# EAGLE schematic L1Demoscene (EAGLE 6.5.0)

## Sheet 1 of 2
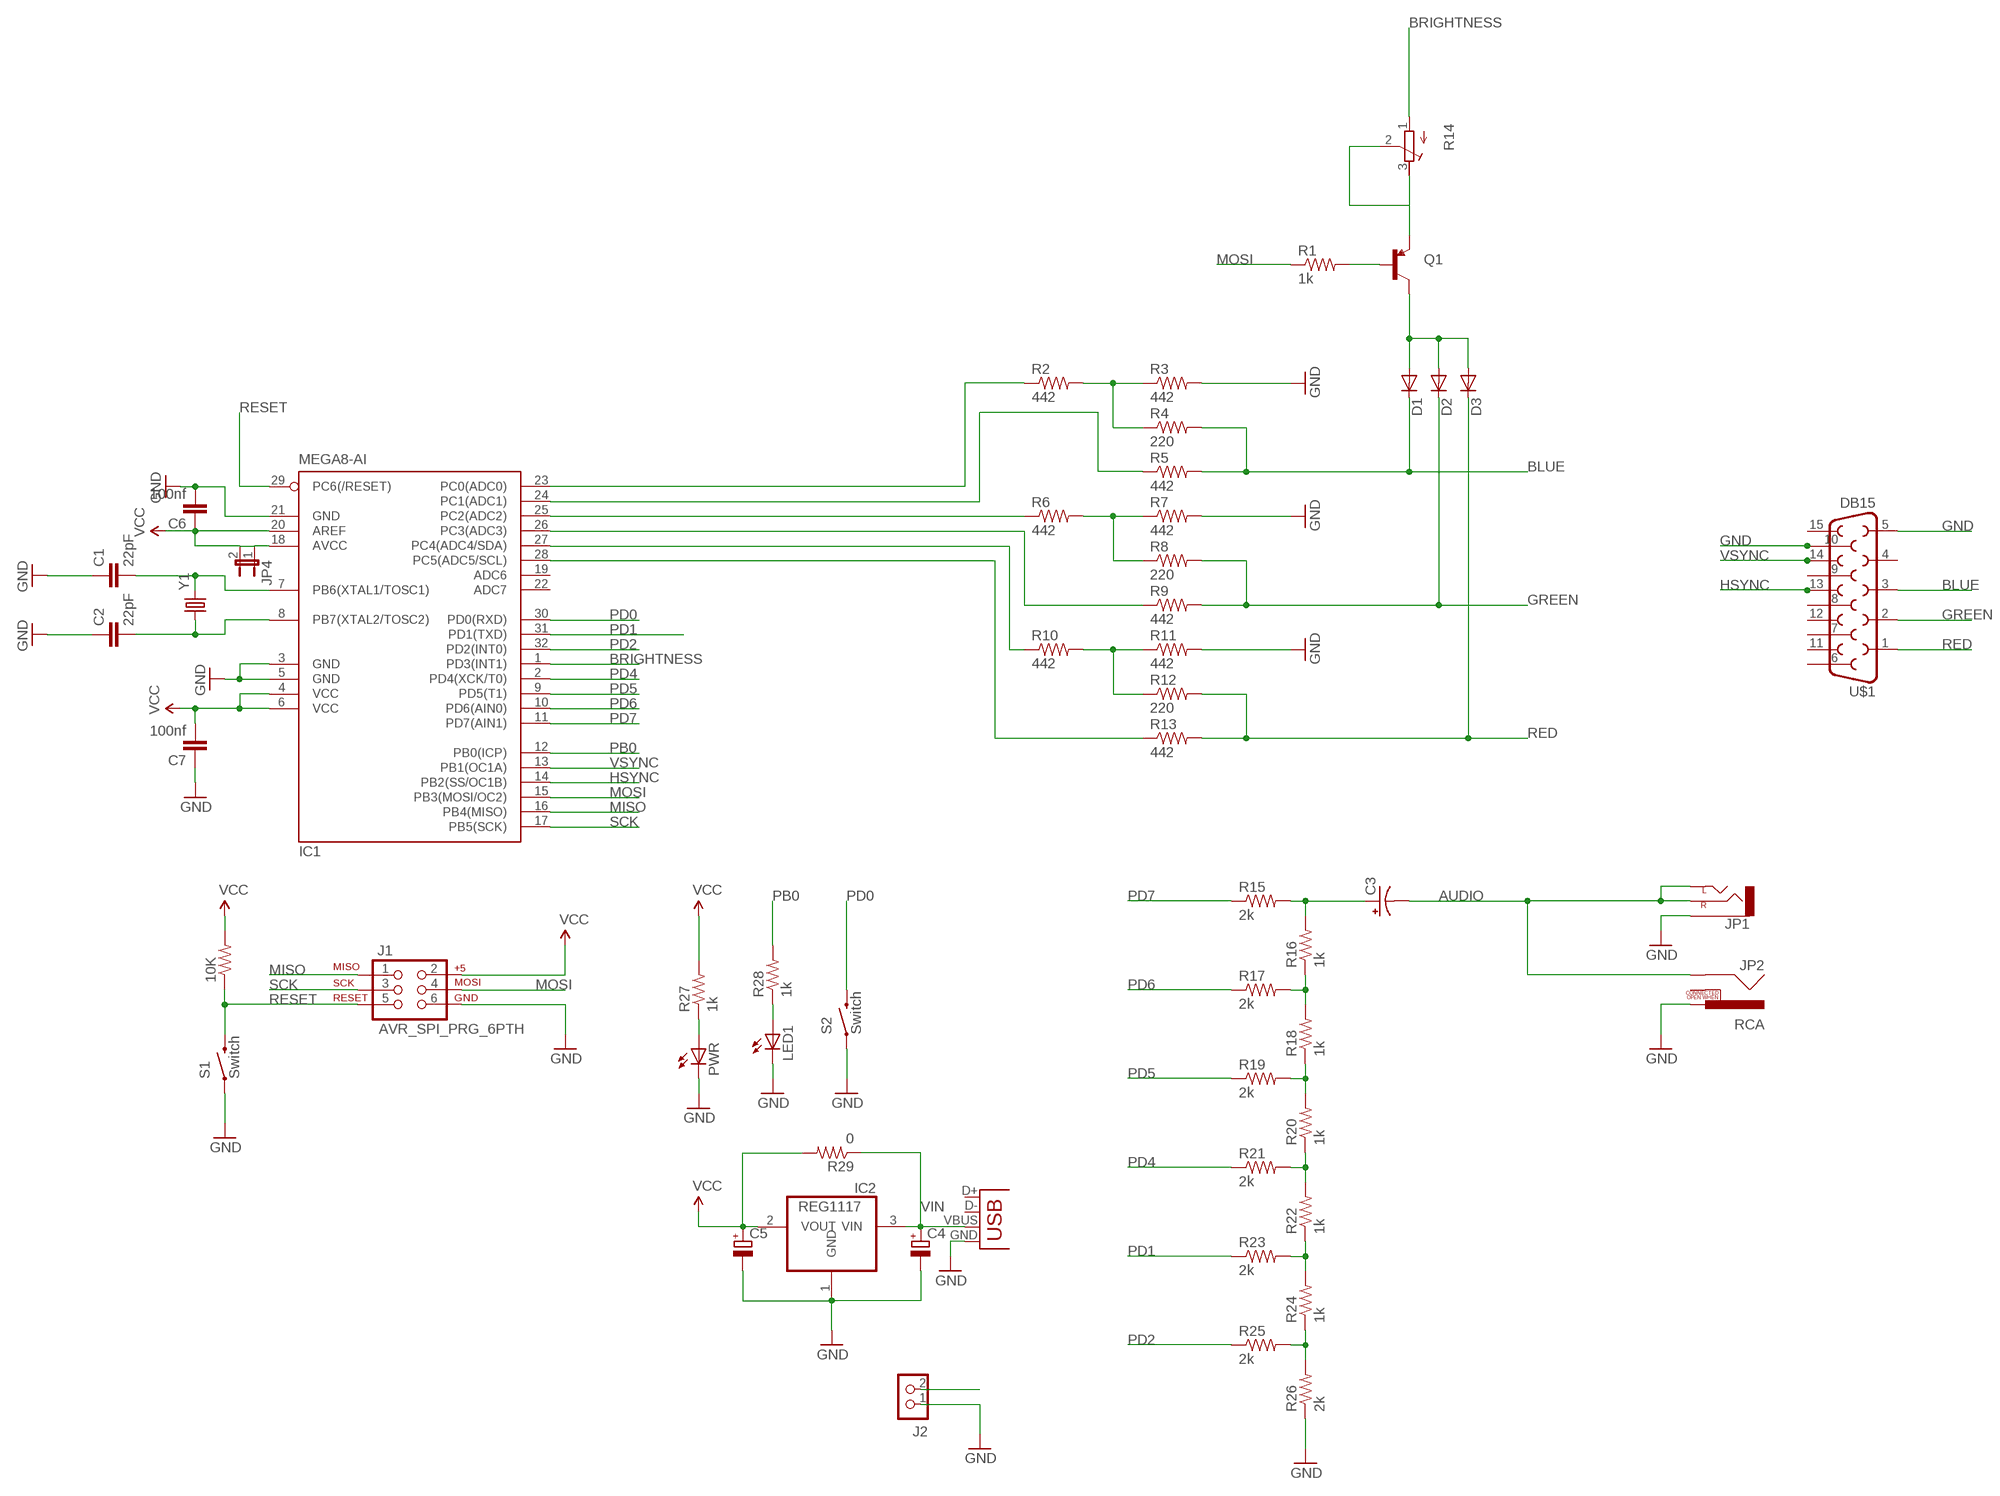
[diagram p0: schematic, sheet 1]

### Parts
10K  RESISTOR0603-RES  [0603-RES]
C1  22pF  CAP0603-CAP  [0603-CAP]
C2  22pF  CAP0603-CAP  [0603-CAP]
C3  CAP_POL1206  [EIA3216]
C4  CAPACITOR_POL-SMC_A  [SMC_A]
C5  CAPACITOR_POL-SMC_A  [SMC_A]
C6  100nf  CAP0603-CAP  [0603-CAP]
C7  100nf  CAP0603-CAP  [0603-CAP]
D1  DIODESOD  [SOD-323]
D2  DIODESOD  [SOD-323]
D3  DIODESOD  [SOD-323]
IC1  MEGA8-AI  [TQFP32-08]
IC2  REG1117  [SOT223]
J1  AVR_SPI_PRG_6PTH  [2X3]
J2  CON_HEADER_1X02-PTH  [M1X2]
JP1  AUDIO-JACKPTH  [AUDIO-JACK]
JP2  RCA  [RCA]
JP3  USB-MICROB  [USB-MICROB]
JP4  JUMPER-2SMD-NC  [SJ_2S]
LED1  LED-0603  [LED-603]
PWR  LED-0603  [LED-603]
Q1  TRANSISTOR_PNPSMD  [SOT23-3]
R1  1k  RESISTOR0603-RES  [0603-RES]
R2  442  RESISTOR0603-RES  [0603-RES]
R3  442  RESISTOR0603-RES  [0603-RES]
R4  220  RESISTOR0603-RES  [0603-RES]
R5  442  RESISTOR0603-RES  [0603-RES]
R6  442  RESISTOR0603-RES  [0603-RES]
R7  442  RESISTOR0603-RES  [0603-RES]
R8  220  RESISTOR0603-RES  [0603-RES]
R9  442  RESISTOR0603-RES  [0603-RES]
R10  442  RESISTOR0603-RES  [0603-RES]
R11  442  RESISTOR0603-RES  [0603-RES]
R12  220  RESISTOR0603-RES  [0603-RES]
R13  442  RESISTOR0603-RES  [0603-RES]
R14  R-TRIMM3296W  [RTRIM3296W]
R15  2k  RESISTOR0603-RES  [0603-RES]
R16  1k  RESISTOR0603-RES  [0603-RES]
R17  2k  RESISTOR0603-RES  [0603-RES]
R18  1k  RESISTOR0603-RES  [0603-RES]
R19  2k  RESISTOR0603-RES  [0603-RES]
R20  1k  RESISTOR0603-RES  [0603-RES]
R21  2k  RESISTOR0603-RES  [0603-RES]
R22  1k  RESISTOR0603-RES  [0603-RES]
R23  2k  RESISTOR0603-RES  [0603-RES]
R24  1k  RESISTOR0603-RES  [0603-RES]
R25  2k  RESISTOR0603-RES  [0603-RES]
R26  2k  RESISTOR0603-RES  [0603-RES]
R27  1k  RESISTOR0603-RES  [0603-RES]
R28  1k  RESISTOR0603-RES  [0603-RES]
R29  0  RESISTOR1206  [1206]
S1  Switch  SPARKFUN-ELECTROMECHANICAL_SWITCH-MOMENTARY-2-SMD-1101NE  [SPARKFUN-ELECTROMECHANICAL_TACTILE-SWITCH-1101NE]
S2  Switch  SPARKFUN-ELECTROMECHANICAL_SWITCH-MOMENTARY-2-SMD-1101NE  [SPARKFUN-ELECTROMECHANICAL_TACTILE-SWITCH-1101NE]
U$1  DB15  [DB15]
Y1  CRYSTALHC49US  [HC49US]

### Nets
AUDIO: C3.C(-) JP1.RING(RIGHT) JP1.TIP(LEFT) JP2.SHELL
BLUE: D1.1(C) R4.2 R5.2 U$1.3
BRIGHTNESS: IC1.1(PD3(INT1)) R14.1(A)
GND: C1.1 C2.1 C4.- C5.- C6.2 C7.1 IC1.3(GND) IC1.5(GND) IC1.21(GND) IC2.1(GND) J1.6 J2.1 JP1.SLEEVE JP2.PIN JP3.GND LED1.C PWR.C R3.2 R7.2 R11.2 R26.1 S1.P$1 S2.P$1 U$1.5 U$1.10
GREEN: D2.1(C) R8.2 R9.2 U$1.2
HSYNC: IC1.14(PB2(SS/OC1B)) U$1.13
MISO: IC1.16(PB4(MISO)) J1.1
MOSI: IC1.15(PB3(MOSI/OC2)) J1.4 R1.1
N$1: C1.2 IC1.7(PB6(XTAL1/TOSC1)) Y1.2
N$2: C2.2 IC1.8(PB7(XTAL2/TOSC2)) Y1.1
N$3: IC1.23(PC0(ADC0)) R2.1
N$4: R2.2 R3.1 R4.1
N$5: D1.2(A) D2.2(A) D3.2(A) Q1.3(C)
N$6: Q1.1(B) R1.2
N$7: IC1.24(PC1(ADC1)) R5.1
N$8: IC1.25(PC2(ADC2)) R6.1
N$9: R6.2 R7.1 R8.1
N$10: PWR.A R27.1
N$11: IC1.26(PC3(ADC3)) R9.1
N$12: IC1.28(PC5(ADC5/SCL)) R13.1
N$13: LED1.A R28.1
N$14: IC1.27(PC4(ADC4/SDA)) R10.1
N$15: R10.2 R11.1 R12.1
N$16: Q1.2(E) R14.2(S) R14.3(E)
N$21: C3.A(+) R15.2 R16.2
N$22: R16.1 R17.2 R18.2
N$23: R18.1 R19.2 R20.2
N$24: R20.1 R21.2 R22.2
N$25: R22.1 R23.2 R24.2
N$26: R24.1 R25.2 R26.2
PB0: IC1.12(PB0(ICP)) R28.2
PD0: IC1.30(PD0(RXD)) S2.P$2
PD1: IC1.31(PD1(TXD)) R23.1
PD2: IC1.32(PD2(INT0)) R25.1
PD4: IC1.2(PD4(XCK/T0)) R21.1
PD5: IC1.9(PD5(T1)) R19.1
PD6: IC1.10(PD6(AIN0)) R17.1
PD7: IC1.11(PD7(AIN1)) R15.1
RED: D3.1(C) R12.2 R13.2 U$1.1
RESET: 10K.1 IC1.29(PC6(/RESET)) J1.5 S1.P$2
SCK: IC1.17(PB5(SCK)) J1.3
VCC: 10K.2 C5.+ C6.1 C7.2 IC1.4(VCC) IC1.6(VCC) IC1.18(AVCC) IC1.20(AREF) IC2.2(VOUT) J1.2 JP4.1 JP4.2 R27.2 R29.2
VIN: C4.+ IC2.3(VIN) J2.2 JP3.VBUS R29.1
VSYNC: IC1.13(PB1(OC1A)) U$1.14
Unconnected: IC1.19(ADC6) IC1.22(ADC7) JP2.SWITCH JP3.D+ JP3.D- U$1.4 U$1.6 U$1.7 U$1.8 U$1.9 U$1.11 U$1.12 U$1.15

## Sheet 2 of 2

## Library data of the parts
10K R1-R13 R15-R29 = SparkFun-Resistors:RESISTOR: Resistor Basic schematic elements and footprints for 0603, 1206, and PTH resistors.
C1 C2 C6 C7 = SparkFun-Capacitors:CAP: Capacitor Standard 0603 ceramic capacitor, and 0.1" leaded capacitor.
C3 = SparkFun-Capacitors:CAP_POL: Capacitor Polarized These are standard SMD and PTH capacitors. Normally 10uF, 47uF, and 100uF in electrolytic and tantalum varieties. Always verify the external diameter of the through hole cap, it varies with capacity, voltage, and manufacturer. The EIA devices should be standard.
C4 C5 = dp_devices:CAPACITOR_POL: Polarized capacitor in various packages
D1-D3 = SparkFun-DiscreteSemi:DIODE: Diode These are standard reverse protection diodes and small signal diodes. SMA package can handle up to about 1A. SOD-323 can handle about 200mA. What the SOD-323 package when ordering, there are some mfgs out there that are 5-pin packages.; PROD_ID: DIO-09646
IC1 = atmel:MEGA8: MICROCONTROLLER 8 Kbytes FLASH, 1 kbytes SRAM, 512 bytes EEPROM, USART, 6-channel 10 bit ADC, 2-channel 8 bit ADC Pin compatible with Atmega48, ATMega88, ATMega168 Source: avr.lbr; MPN: ATMEGA8-16AU; OC_FARNELL: 9171371; OC_NEWARK: 73M8863
IC2 = burr-brown:REG1117: 800mA and 1A Low Dropout (LDO) Positive Regulator 1.8V, 2.5V, 2.85V, 3.3V, 5V, and Adj; MPN: REG1117; OC_FARNELL: 1097566; OC_NEWARK: 14P6981
J1 = SparkFun-Connectors:AVR_SPI_PRG_6: AVR ISP 6 Pin This is the reduced ISP connector for AVR programming. Common on Arduino. This footprint will take up less PCB space and can be used with a 10-pin to 6-pin adapter such as SKU: BOB-08508
J2 = dp_devices:CON_HEADER_1X02
JP1 = SparkFun-Connectors:AUDIO-JACK: 3.5mm Audio Jack Simple 3.5mm common PCB mount audio jack. SKU: PRT-08032
JP2 = SparkFun-Connectors:RCA
JP3 = STM32-PROX:USB: USB Connectors USB-B-PTH is fully proven SKU : PRT-00139 USB-miniB is fully proven SKU : PRT-00587 USB-A-PCB is untested. USB-A-H is throughly reviewed, but untested. Spark Fun Electronics SKU : PRT-00437 USB-B-SMT is throughly reviewed, but untested. Needs silkscreen touching up. USB-A-S has not been used/tested USB-MB-H has not been used/tested
JP4 = SparkFun-Passives:JUMPER-2: Jumper Basic 0.1" spaced jumper. Use with breakaway headers.
LED1 PWR = dp_devices:LED: Light Emitting Diode
Q1 = SparkFun-DiscreteSemi:TRANSISTOR_PNP: Generic PNP BJT Double check pinouts against datasheets- not all devices are the same! MMBT3906 - 40V 200mA SOT-23 (TRANS-08052) MMBT4403 - 40V 600mA SOT-23 (TRANS-09245)
R14 = rcl:R-TRIMM: Trimm resistor
S1 S2 = tvbgone-2layer:SPARKFUN-ELECTROMECHANICAL_SWITCH-MOMENTARY-2: Various NO switches- pushbuttons, reed, etc
U$1 = SparkFun-Connectors:DB15: DB15 / VGA right angle through-hole female connector.
Y1 = SparkFun-FreqCtrl:CRYSTAL: Various standard crystals. Proven footprints. Spark Fun Electronics SKU : COM-00534